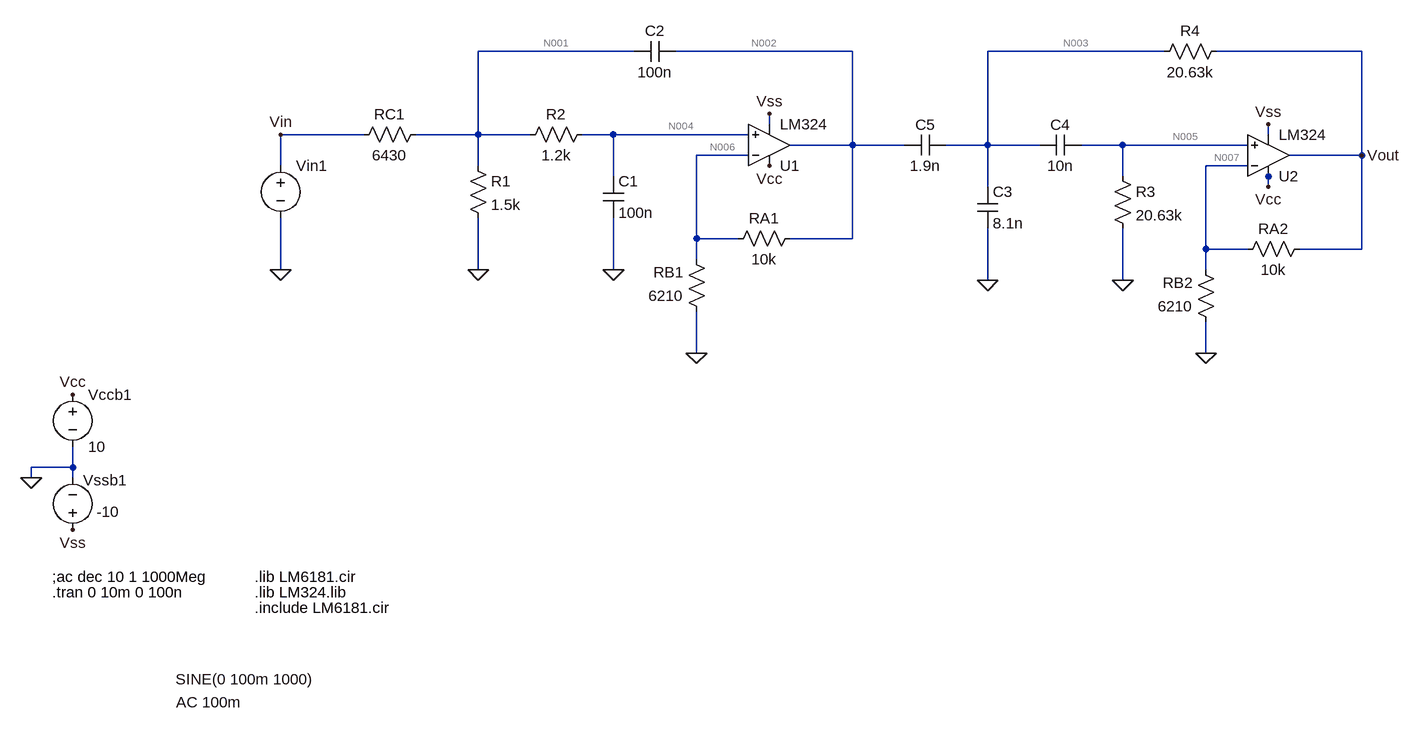
[diagram p0: schematic Circuito_Completo.asc]
Circuito_Completo.asc, the LTspice schematic file:
Version 4
SHEET 1 1788 748
WIRE 624 -272 384 -272
WIRE 960 -272 688 -272
WIRE 1440 -272 1168 -272
WIRE 1744 -272 1520 -272
WIRE 832 -160 832 -176
WIRE 208 -144 80 -144
WIRE 384 -144 384 -272
WIRE 384 -144 288 -144
WIRE 464 -144 384 -144
WIRE 592 -144 544 -144
WIRE 800 -144 592 -144
WIRE 1600 -144 1600 -160
WIRE 960 -128 960 -272
WIRE 960 -128 864 -128
WIRE 1040 -128 960 -128
WIRE 1168 -128 1168 -272
WIRE 1168 -128 1104 -128
WIRE 1248 -128 1168 -128
WIRE 1376 -128 1312 -128
WIRE 1568 -128 1376 -128
WIRE 800 -112 720 -112
WIRE 1744 -112 1744 -272
WIRE 1744 -112 1632 -112
WIRE 80 -96 80 -144
WIRE 384 -96 384 -144
WIRE 1568 -96 1504 -96
WIRE 592 -80 592 -144
WIRE 1376 -80 1376 -128
WIRE 1600 -80 1600 -96
WIRE 1168 -64 1168 -128
WIRE 1600 -64 1600 -80
WIRE 720 16 720 -112
WIRE 784 16 720 16
WIRE 960 16 960 -128
WIRE 960 16 864 16
WIRE 1504 32 1504 -96
WIRE 1568 32 1504 32
WIRE 1744 32 1744 -112
WIRE 1744 32 1648 32
WIRE 720 48 720 16
WIRE 80 64 80 -16
WIRE 384 64 384 -16
WIRE 592 64 592 -16
WIRE 1504 64 1504 32
WIRE 1168 80 1168 0
WIRE 1376 80 1376 0
WIRE 720 192 720 128
WIRE 1504 192 1504 144
WIRE -240 368 -240 336
WIRE -240 368 -304 368
WIRE -304 384 -304 368
WIRE -240 384 -240 368
FLAG 832 -176 Vss
FLAG 832 -96 Vcc
FLAG 80 64 0
FLAG -304 384 0
FLAG -240 256 Vcc
FLAG -240 464 Vss
FLAG 384 64 0
FLAG 592 64 0
FLAG 720 192 0
FLAG 1168 80 0
FLAG 1376 80 0
FLAG 1504 192 0
FLAG 1744 -112 Vout
FLAG 80 -144 Vin
FLAG 1600 -160 Vss
FLAG 1600 -64 Vcc
SYMBOL voltage 80 -112 R0
WINDOW 123 -161 841 Left 2
WINDOW 39 0 0 Left 0
WINDOW 3 -162 806 Left 2
SYMATTR Value2 AC 100m
SYMATTR Value SINE(0 100m 1000)
SYMATTR InstName Vin1
SYMBOL voltage -240 240 R0
WINDOW 123 0 0 Left 0
WINDOW 39 0 0 Left 0
SYMATTR InstName Vccb1
SYMATTR Value 10
SYMBOL voltage -240 480 R180
WINDOW 123 0 0 Left 0
WINDOW 39 0 0 Left 0
WINDOW 0 -83 92 Left 2
WINDOW 3 -72 44 Left 2
SYMATTR InstName Vssb1
SYMATTR Value -10
SYMBOL res 304 -160 R90
WINDOW 0 0 56 VBottom 2
WINDOW 3 32 56 VTop 2
SYMATTR InstName RC1
SYMATTR Value 6430
SYMBOL cap 576 -80 R0
SYMATTR InstName C1
SYMATTR Value 100n
SYMBOL cap 688 -288 R90
WINDOW 0 0 32 VBottom 2
WINDOW 3 32 32 VTop 2
SYMATTR InstName C2
SYMATTR Value 100n
SYMBOL res 368 -112 R0
SYMATTR InstName R1
SYMATTR Value 1.5k
SYMBOL res 560 -160 R90
WINDOW 0 0 56 VBottom 2
WINDOW 3 32 56 VTop 2
SYMATTR InstName R2
SYMATTR Value 1.2k
SYMBOL res 880 0 R90
WINDOW 0 0 56 VBottom 2
WINDOW 3 32 56 VTop 2
SYMATTR InstName RA1
SYMATTR Value 10k
SYMBOL res 736 144 R180
WINDOW 0 36 76 Left 2
WINDOW 3 36 40 Left 2
SYMATTR InstName RB1
SYMATTR Value 6210
SYMBOL cap 1152 -64 R0
SYMATTR InstName C3
SYMATTR Value 8.1n
SYMBOL cap 1312 -144 R90
WINDOW 0 0 32 VBottom 2
WINDOW 3 32 32 VTop 2
SYMATTR InstName C4
SYMATTR Value 10n
SYMBOL res 1360 -96 R0
SYMATTR InstName R3
SYMATTR Value 20.63k
SYMBOL res 1536 -288 R90
WINDOW 0 0 56 VBottom 2
WINDOW 3 32 56 VTop 2
SYMATTR InstName R4
SYMATTR Value 20.63k
SYMBOL res 1664 16 R90
WINDOW 0 0 56 VBottom 2
WINDOW 3 32 56 VTop 2
SYMATTR InstName RA2
SYMATTR Value 10k
SYMBOL res 1520 160 R180
WINDOW 0 36 76 Left 2
WINDOW 3 36 40 Left 2
SYMATTR InstName RB2
SYMATTR Value 6210
SYMBOL OpAmps\\opamp2 832 -64 M180
SYMATTR InstName U1
SYMATTR Value LM324
SYMBOL OpAmps\\opamp2 1600 -48 M180
SYMATTR InstName U2
SYMATTR Value LM324
SYMBOL cap 1104 -144 R90
WINDOW 0 0 32 VBottom 2
WINDOW 3 32 32 VTop 2
SYMATTR InstName C5
SYMATTR Value 1.9n
TEXT 40 560 Left 2 !.lib LM324.lib
TEXT -272 536 Left 2 !;ac dec 10 1 1000Meg
TEXT -272 560 Left 2 !.tran 0 10m 0 100n
TEXT 40 536 Left 2 !.lib LM6181.cir
TEXT 40 584 Left 2 !.include LM6181.cir

The netlist it stands for:
* Circuito_Completo.asc
Vin1 Vin 0 SINE(0 100m 1000) AC 100m
Vccb1 Vcc 0 10
Vssb1 Vss 0 -10
RC1 N001 Vin 6430
C1 N004 0 100n
C2 N002 N001 100n
R1 N001 0 1.5k
R2 N004 N001 1.2k
RA1 N002 N006 10k
RB1 0 N006 6210
C3 N003 0 8.1n
C4 N005 N003 10n
R3 N005 0 20.63k
R4 Vout N003 20.63k
RA2 Vout N007 10k
RB2 0 N007 6210
XU1 N004 N006 Vcc Vss N002 LM324  ; pins In+ In- V+ V- OUT
XU2 N005 N007 Vcc Vss Vout LM324  ; pins In+ In- V+ V- OUT
C5 N003 N002 1.9n
.lib LM324.lib
;ac dec 10 1 1000Meg
.tran 0 10m 0 100n
.lib LM6181.cir
.include LM6181.cir
.backanno
.end

* Results of the author's LTspice run, read from the files saved beside the schematic
* Operating Point, zero values left out:
*   V(vcc) = 10 V
*   V(vss) = -10 V
*   V(n001) = 24.23 µV
*   V(n004) = 48.14 µV
*   V(n002) = -161.6 µV
*   V(n006) = 14.48 µV
*   V(n003) = 785.5 µV
*   V(n005) = 411 µV
*   V(vout) = 785.5 µV
*   V(n007) = 377.3 µV
*   I(Rc1) = 3.768 nA
*   I(R1) = 16.15 nA
*   I(R2) = 19.92 nA
*   I(Ra1) = -17.61 nA
*   I(Rb1) = -2.332 nA
*   I(R3) = 19.92 nA
*   I(Ra2) = 40.82 nA
*   I(Rb2) = -60.76 nA
*   I(Vin1) = 3.768 nA
*   I(Vccb1) = -1.34 mA
*   I(Vssb1) = 1.34 mA
*   Ix(u1:1) = -19.92 nA
*   Ix(u1:2) = -19.94 nA
*   Ix(u1:3) = 669.9 µA
*   Ix(u1:4) = -669.8 µA
*   Ix(u1:5) = 17.61 nA
*   Ix(u2:1) = -19.92 nA
*   Ix(u2:2) = -19.94 nA
*   Ix(u2:3) = 669.9 µA
*   Ix(u2:4) = -669.8 µA
*   Ix(u2:5) = -40.82 nA
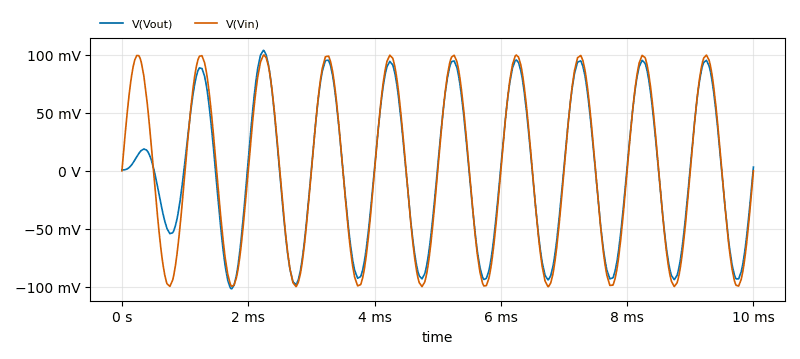
[diagram p1: Transient Analysis of Circuito_Completo.asc, plotted from the saved traces]
* Transient Analysis, 1 run:
*   V(Vout): min -101.9 mV, max 104 mV, average -719.3 µV, rms 64.59 mV, last 3.195 mV
*   V(Vin): min -99.99 mV, max 100 mV, average 311.3 nV, rms 70.58 mV, last 0 V